# Altium schematic sheet Keyboard.SchDoc
size A4
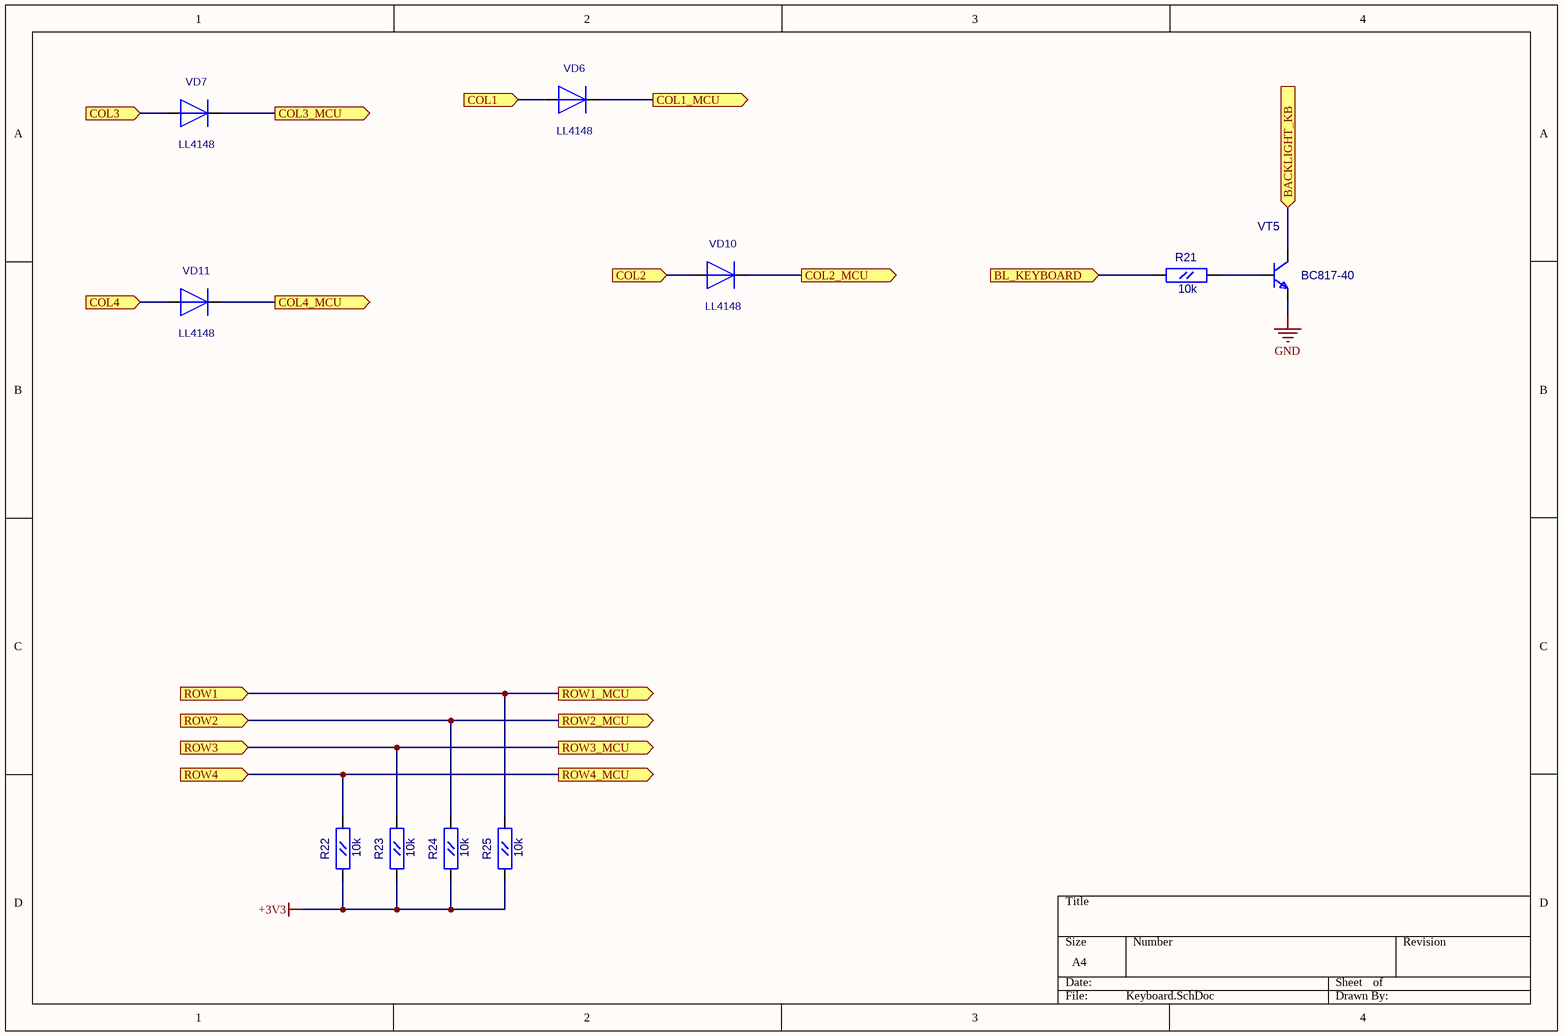
[diagram p0: Keyboard.SchDoc]

## Parts
R21  10k  [RC0603]
R22  10k  [RC0603]
R23  10k  [RC0603]
R24  10k  [RC0603]
R25  10k  [RC0603]
VD6  LL4148  [SOD-80]
VD7  LL4148  [SOD-80]
VD10  LL4148  [SOD-80]
VD11  LL4148  [SOD-80]
VT5  BC817-40  [SOT-23(123)]

## Ports
BACKLIGHT_KB (in), BL_KEYBOARD (in), COL1 (in), COL1_MCU (out), COL2 (in), COL2_MCU (out), COL3 (in), COL3_MCU (out), COL4 (in), COL4_MCU (out), ROW1 (in), ROW1_MCU (out), ROW2 (in), ROW2_MCU (out), ROW3 (in), ROW3_MCU (out), ROW4 (in), ROW4_MCU (out)

## Nets
+3V3: R22.1(A) R23.1(A) R24.1(A) R25.1(A)
GND: VT5.2(E)
BACKLIGHT_KB: VT5.3(C) ; port BACKLIGHT_KB
BL_KEYBOARD: R21.1(A) ; port BL_KEYBOARD
COL1: VD6.1(-) ; port COL1
COL1_MCU: VD6.2(+) ; port COL1_MCU
COL2: VD10.1(-) ; port COL2
COL2_MCU: VD10.2(+) ; port COL2_MCU
COL3: VD7.1(-) ; port COL3
COL3_MCU: VD7.2(+) ; port COL3_MCU
COL4: VD11.1(-) ; port COL4
COL4_MCU: VD11.2(+) ; port COL4_MCU
ROW1: R25.2(B) ; port ROW1_MCU, port ROW1
ROW2: R24.2(B) ; port ROW2_MCU, port ROW2
ROW3: R23.2(B) ; port ROW3_MCU, port ROW3
ROW4: R22.2(B) ; port ROW4_MCU, port ROW4
NetR21_2: R21.2(B) VT5.1(B)

## Library data of the parts
R21-R25 = RC0603: Value: 10k
VT5 = BC846BLT1: NPN 500ma transistor; ComponentField7: Published 29-Sep-2000; OriginalName: BC846BLT1; Value: BC817-40
VD6 VD7 VD10 VD11 = LL4148: Value: *